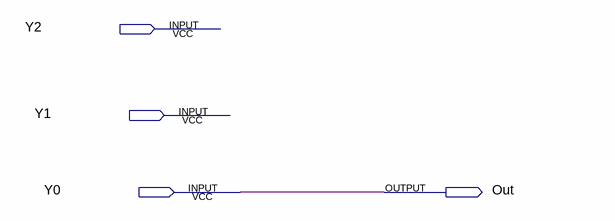
[diagram p0: schematic sheet]
// Quartus schematic ol.bdf as structural Verilog: 0 symbols, 4 pins
module ol (
  input  Y2,
  input  Y1,
  input  Y0,
  output Out
);


  assign Out = Y0;
endmodule
